# Altium project WPT Round 2.1 RX.PrjPcb
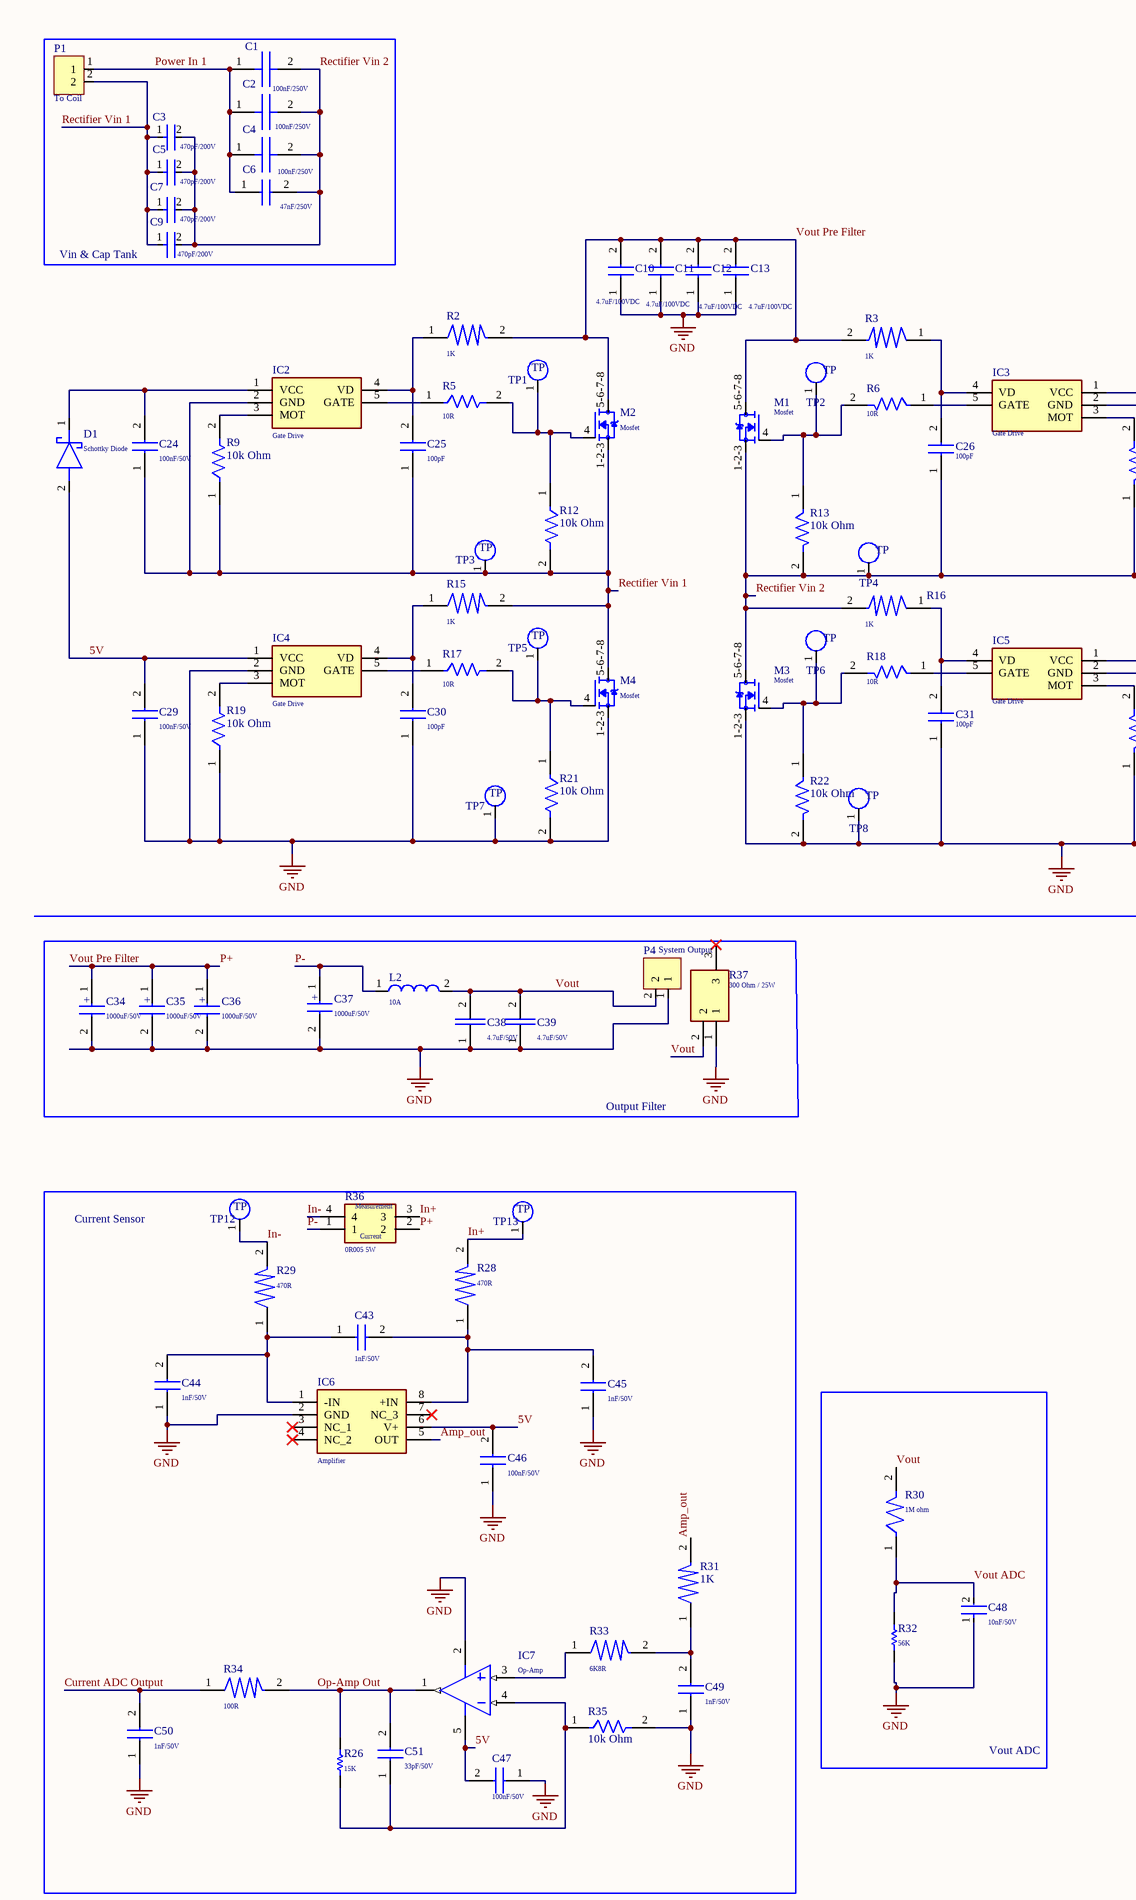
[diagram p0: WPT Round 2.1 RX Schematics.SchDoc, left]
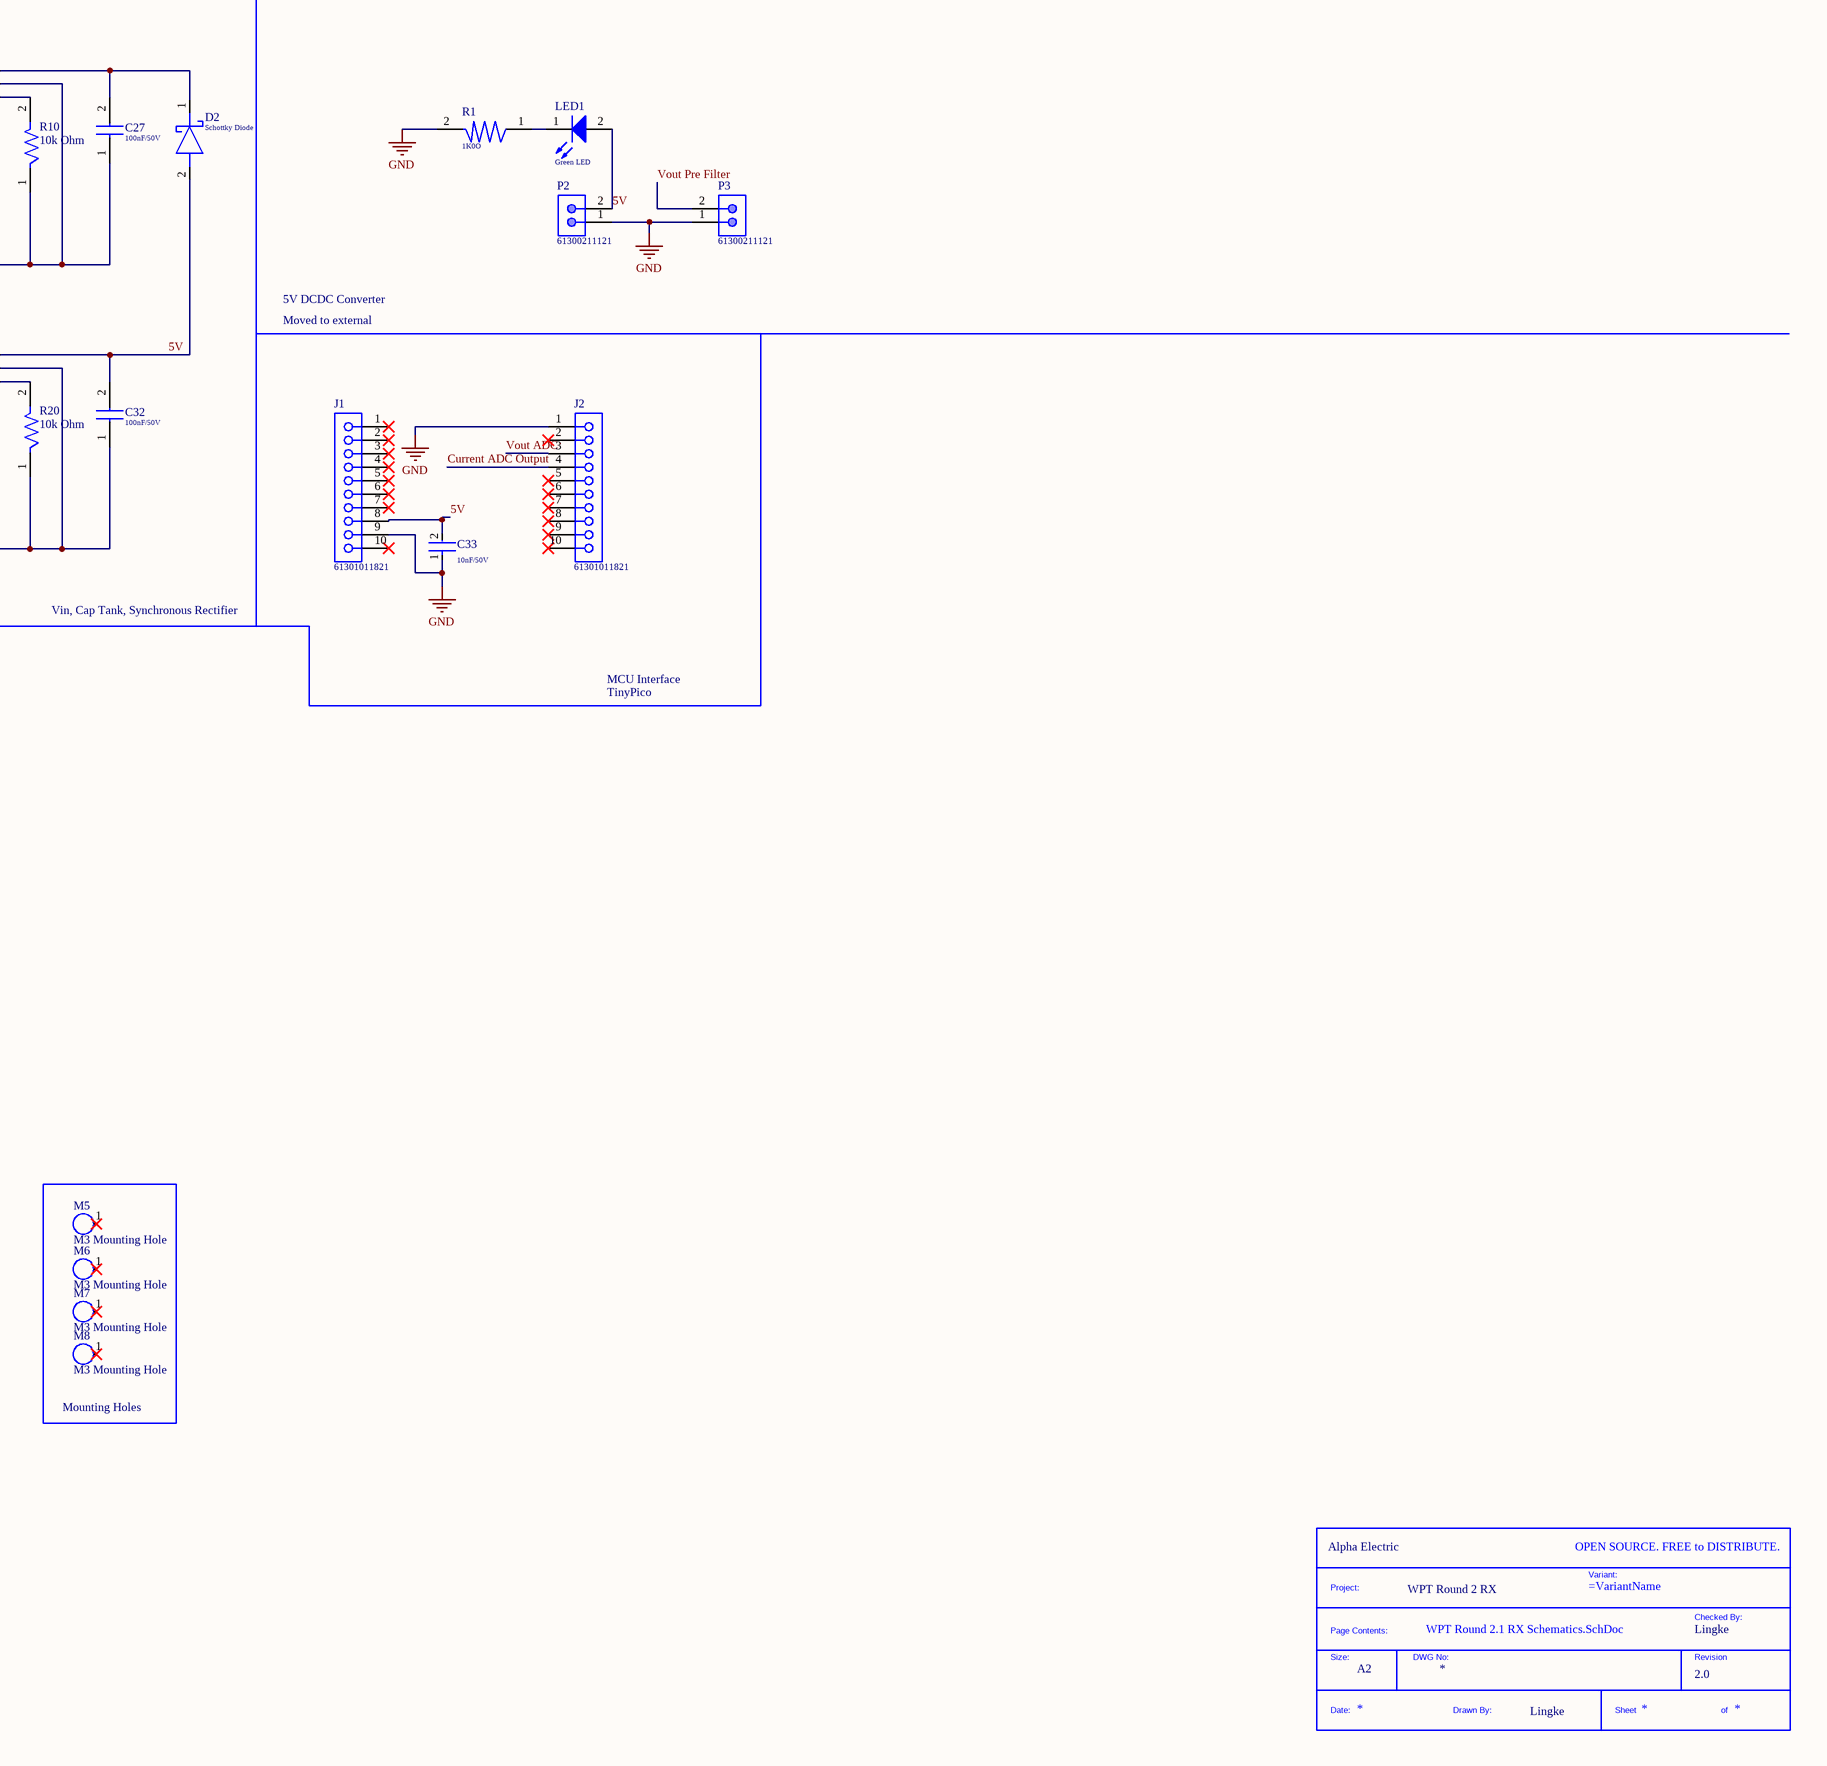
[diagram p1: WPT Round 2.1 RX Schematics.SchDoc, right]
1 sheet, 99 parts. Net scope: global (net labels, ports and power ports of the same name join across sheets).
Board file: WPT Round 2.1 RX Layout.PcbDoc

## Sheet WPT Round 2.1 RX Schematics.SchDoc
size A2

### Parts
*  Project Name: WPT Round 2 RX  Company: Alpha Electric  Drawn By: Lingke  Revision: 2.0  Size: A2  (hidden comment: Title_Block)  (no BOM)
C1  100nF/250V  [CAPC4532X220N]
C2  100nF/250V  [CAPC4532X220N]
C3  470pF/200V  [FP-C1206C-EB-MFG]
C4  100nF/250V  [CAPC4532X220N]
C5  470pF/200V  [FP-C1206C-EB-MFG]
C6  47nF/250V  [CAPC4532X350N]
C7  470pF/200V  [FP-C1206C-EB-MFG]
C9  470pF/200V  [FP-C1206C-EB-MFG]
C10  4.7uF/100VDC  [CAPC3225X280N]
C11  4.7uF/100VDC  [CAPC3225X280N]
C12  4.7uF/100VDC  [CAPC3225X280N]
C13  4.7uF/100VDC  [CAPC3225X280N]
C24  100nF/50V  [CAPC2012X90N]
C25  100pF  [CAPC2012X70N]
C26  100pF  [CAPC2012X70N]
C27  100nF/50V  [CAPC2012X90N]
C29  100nF/50V  [CAPC2012X90N]
C30  100pF  [CAPC2012X70N]
C31  100pF  [CAPC2012X70N]
C32  100nF/50V  [CAPC2012X90N]
C33  10nF/50V  [0805 Capacitor]
C34  1000uF/50V  [CAPPRD500W62D1300H2650]
C35  1000uF/50V  [CAPPRD500W62D1300H2650]
C36  1000uF/50V  [CAPPRD500W62D1300H2650]
C37  1000uF/50V  [CAPPRD500W62D1300H2650]
C38  4.7uF/50V  [CAPC3225X280N]
C39  4.7uF/50V  [CAPC3225X280N]
C43  1nF/50V  [CAPC2012X90N]
C44  1nF/50V  [CAPC2012X90N]
C45  1nF/50V  [CAPC2012X90N]
C46  100nF/50V  [CAPC2012X90N]
C47  100nF/50V  [CAPC2012X90N]
C48  10nF/50V  [0805 Capacitor]
C49  1nF/50V  [CAPC2012X90N]
C50  1nF/50V  [CAPC2012X90N]
C51  33pF/50V  [CAPC2012X90N]
D1  Schottky Diode  [RB400VAM50TR]
D2  Schottky Diode  [RB400VAM50TR]
IC2  Gate Drive  [SOT95P280X145-5N]
IC3  Gate Drive  [SOT95P280X145-5N]
IC4  Gate Drive  [SOT95P280X145-5N]
IC5  Gate Drive  [SOT95P280X145-5N]
IC6  Amplifier  [SOIC127P600X175-8N]
IC7  Op-Amp  [ADI-RJ-5_N]
J1  61301011821  [61301011821]
J2  61301011821  [61301011821]
L2  10A  [WE-PF_1280]
LED1  Green LED  [0805_A]
M1  Mosfet  [TRANS_BSZ037N06LS5ATMA1]
M2  Mosfet  [TRANS_BSZ037N06LS5ATMA1]
M3  Mosfet  [TRANS_BSZ037N06LS5ATMA1]
M4  Mosfet  [TRANS_BSZ037N06LS5ATMA1]
M5  M3 Mounting Hole  [M3 Hole]
M6  M3 Mounting Hole  [M3 Hole]
M7  M3 Mounting Hole  [M3 Hole]
M8  M3 Mounting Hole  [M3 Hole]
P1  To Coil  [691404910002B]
P2  61300211121  [61300211121]
P3  61300211121  [61300211121]
P4  System Output  [691404910002B]
R1  1K0O  [FP-CRCW0805-e3-MFG]
R2  1K  [FP-CRCW0805-e3-MFG]
R3  1K  [FP-CRCW0805-e3-MFG]
R5  10R  [FP-CRCW1206-e3-IPC_A]
R6  10R  [FP-CRCW1206-e3-IPC_A]
R9  10k Ohm  [0805 Resistor]
R10  10k Ohm  [0805 Resistor]
R12  10k Ohm  [0805 Resistor]
R13  10k Ohm  [0805 Resistor]
R15  1K  [FP-CRCW0805-e3-MFG]
R16  1K  [FP-CRCW0805-e3-MFG]
R17  10R  [FP-CRCW1206-e3-IPC_A]
R18  10R  [FP-CRCW1206-e3-IPC_A]
R19  10k Ohm  [0805 Resistor]
R20  10k Ohm  [0805 Resistor]
R21  10k Ohm  [0805 Resistor]
R22  10k Ohm  [0805 Resistor]
R26  15K  [0805 Resistor]
R28  470R  [FP-CRCW0805-e3-MFG]
R29  470R  [FP-CRCW0805-e3-MFG]
R30  1M ohm  [FP-CRCW0805-e3-MFG]
R31  1K  [FP-CRCW0805-e3-MFG]
R32  56K  [0805 Resistor]
R33  6K8R  [FP-CRCW0805-e3-MFG]
R34  100R  [FP-CRCW0805-e3-MFG]
R35  10k Ohm  [0805 Resistor]
R36  0R005 5W  [FC4L110R005FER]
R37  300 Ohm / 25W  [PWR163S253000FE]
TP1  TP  [Test Point]  (value not drawn)  (no BOM)
TP2  TP  [Test Point]  (value not drawn)  (no BOM)
TP3  TP  [Test Point]  (value not drawn)  (no BOM)
TP4  TP  [Test Point]  (value not drawn)  (no BOM)
TP5  TP  [Test Point]  (value not drawn)  (no BOM)
TP6  TP  [Test Point]  (value not drawn)  (no BOM)
TP7  TP  [Test Point]  (value not drawn)  (no BOM)
TP8  TP  [Test Point]  (value not drawn)  (no BOM)
TP12  TP  [Test Point]  (value not drawn)  (no BOM)
TP13  TP  [Test Point]  (value not drawn)  (no BOM)

### Blocks framed on the sheet
Vin & Cap Tank: C1-C7 C9 P1
Output Filter: C34-C39 L2 P4 R37
Current Sensor: C43-C47 C49-C51 IC6 IC7 R26 R28 R29 R31 R33-R36 TP12 TP13
Vout ADC: C48 R30 R32
Mounting Holes: M5-M8

### Nets
GND: C10.1 C11.1 C12.1 C13.1 C29.1 C30.1 C31.1 C32.1 C33.1 C34.2(-) C35.2(-) C36.2(-) C37.2(-) C38.1 C39.1 C44.1 C45.1 C46.1 C47.1 C48.1 C49.1 C50.1 IC4.2(GND) IC5.2(GND) IC6.2(GND) IC7.2(-VS) J1.9 J2.1 M3.1-2-3(S) M4.1-2-3(S) P2.1 P3.1 P4.1 R1.2 R19.1 R20.1 R21.2 R22.2 R32.1 R35.2 R37.1 TP7.1(TP) TP8.1(TP)
5V: C29.2 C32.2 C33.2 C46.2 C47.2 D1.2(A) D2.2(A) IC4.1(VCC) IC5.1(VCC) IC6.6(V+) IC7.5(+VS) J1.8 LED1.2(A) P2.2
Amp_out: IC6.5(OUT) R31.2
Current ADC Output: C50.2 J2.4 R34.1
In+: R28.2 R36.3 TP13.1(TP)
In-: R29.2 R36.4 TP12.1(TP)
Op-Amp Out: C51.2(C2) IC7.1(VOUT) R26.2 R34.2
P+: C10.2 C11.2 C12.2 C13.2 C34.1(+) C35.1(+) C36.1(+) M1.5-6-7-8(D) M2.5-6-7-8(D) P3.2 R2.2 R3.2 R36.2  [also labelled Vout Pre Filter]
P-: C37.1(+) L2.1 R36.1
Power In 1: C1.1 C2.1 C4.1 C6.1 P1.1
Rectifier Vin 1: C3.1 C5.1 C7.1 C9.1 C24.1 C25.1 IC2.2(GND) M2.1-2-3(S) M4.5-6-7-8(D) P1.2 R9.1 R12.2 R15.2 TP3.1(TP)
Rectifier Vin 2: C1.2 C2.2 C3.2 C4.2 C5.2 C6.2 C7.2 C9.2 C26.1 C27.1 IC3.2(GND) M1.1-2-3(S) M3.5-6-7-8(D) R10.1 R13.2 R16.2 TP4.1(TP)
Vout: C38.2 C39.2 L2.2 P4.2 R30.2 R37.2
Vout ADC: C48.2 J2.3 R30.1 R32.2
NetC24_2: C24.2 D1.1(K) IC2.1(VCC)
NetC25_2: C25.2 IC2.4(VD) R2.1
NetC26_2: C26.2 IC3.4(VD) R3.1
NetC27_2: C27.2 D2.1(K) IC3.1(VCC)
NetC30_2: C30.2 IC4.4(VD) R15.1
NetC31_2: C31.2 IC5.4(VD) R16.1
NetC43_1: C43.1 C44.2 IC6.1(-IN) R29.1
NetC43_2: C43.2 C45.2 IC6.8(+IN) R28.1
NetC49_2: C49.2 R31.1 R33.2
NetC51_1: C51.1(C1) IC7.4(-IN) R26.1 R35.1
NetIC2_3: IC2.3(MOT) R9.2
NetIC2_5: IC2.5(GATE) R5.1
NetIC3_3: IC3.3(MOT) R10.2
NetIC3_5: IC3.5(GATE) R6.1
NetIC4_3: IC4.3(MOT) R19.2
NetIC4_5: IC4.5(GATE) R17.1
NetIC5_3: IC5.3(MOT) R20.2
NetIC5_5: IC5.5(GATE) R18.1
NetIC7_3: IC7.3(+IN) R33.1
NetLED1_1: LED1.1(K) R1.1
NetM1_4: M1.4(G) R6.2 R13.1 TP2.1(TP)
NetM2_4: M2.4(G) R5.2 R12.1 TP1.1(TP)
NetM3_4: M3.4(G) R18.2 R22.1 TP6.1(TP)
NetM4_4: M4.4(G) R17.2 R21.1 TP5.1(TP)

Not connected (* = marked no-connect by the designer): IC6 3(NC_1)* 4(NC_2)* 7(NC_3)*; J1 1* 2* 3* 4* 5* 6* 7* 10*; J2 2* 5* 6* 7* 8* 9* 10*; M5 1*; M6 1*; M7 1*; M8 1*; R37 3*

### Notes on the sheet
- 5V DCDC Converter
- Moved to external
- Vin, Cap Tank, Synchronous Rectifier
- MCU Interface
- TinyPico
- (in symbol FC4L110R005FER) Measurement; Current
- (in symbol Title_Block) OPEN SOURCE. FREE to DISTRIBUTE.; Variant:; Project:; Checked By:; Page Contents:; Size:; DWG No:; Revision; Date:; Drawn By:; Sheet; of

### Library data of the parts
* = Title_Block: Standard Title Block.; DWG No: *; Checked By: Lingke
C1 C2 C4 = C1812C104JAGACAUTO: Manufacturer_Name: Kemet; Datasheet Link: https://api.kemet.com/component-edge/download/datasheet/C1812C104JAGACAUTO.pdf; Height: 2.2mm; Manufacturer_Part_Number: C1812C104JAGACAUTO; Supplier Part Number 1: 80-C1812C104JAGAUTO; Supplier 1: Mouser
C3 C5 C7 C9 = C1206C471K2GACTU: CAP CER 470PF 200V 10% NP0 1206; Manufacturer: KEMET; Temperature Coefficient: 15%; Material: Ceramic; Tolerance: 0.1; Automotive Grade: Grade 0; Temperature Characteristic: C0G; Temperature Range High: +150°C; Octopart: https://octopart.com/c1206c471k2gactu-kemet-3658280; Value: 470 pF; ComponentLink2URL: https://content.kemet.com/datasheets/KEM_C1007_X8R_ULTRA_150C_SMD.pdf; Package: C1206C-EB; Ipc Land Pattern Name: CAPC320160X78; Digikey Description: CAP CER 470PF 200V 10% NP0 1206; Device Class L2: Capacitors; Lead Free: Yes; Voltage Rating: 200 V; ComponentLink2Description: Datasheet; Height: 0.88mm; RoHS: TRUE; Temperature Range Low: -55°C; Device Class L1: Passive Components; Device Class L3: Ceramic Capacitors; Category: Cap; Mouser Description: Multilayer Ceramic Capacitors MLCC - SMD/SMT 200volts 470pF C0G 10%; Temperature: -55°C to +150°C; Capacitance: 470 pF; Manufacturer Part Number: C1206C471K2GACTU; Automotive: Yes
C6 = C4532C0G2E473J320KA: Capacitor / 47nF/250V / C0G; Manufacturer_Name: TDK; Datasheet Link: https://product.tdk.com/info/en/catalog/datasheets/mlcc_commercial_midvoltage_en.pdf; Height: 3.5mm; Manufacturer_Part_Number: C4532C0G2E473J320KA; Supplier 1: Mouser; Supplier Part Number 1: 810-C4532C0G2E473J
C10-C13 = CNC6P1X7R2A475K250AE: Manufacturer_Name: TDK; Datasheet Link: https://componentsearchengine.com//CNC6P1X7R2A475K250AE.pdf; Height: 2.8mm; Mouser2 Part Number: 810-CNC6P1X7R2A475K2; Mouser2 Price/Stock: https://www.mouser.com/Search/Refine.aspx?Keyword=810-CNC6P1X7R2A475K2; Manufacturer_Part_Number: CNC6P1X7R2A475K250AE; Supplier 1: Mouser; Supplier Part Number 1: 810-CNC6P1X7R2A475K2
C24 C27 C29 C32 = 885012207098: Capacitor 100nF/50V; Manufacturer_Name: Wurth Elektronik; Datasheet Link: https://componentsearchengine.com//885012207098.pdf; Height: 0.9mm; Mouser2 Part Number: 710-885012207098; Mouser2 Price/Stock: https://www.mouser.com/Search/Refine.aspx?Keyword=710-885012207098; Manufacturer_Part_Number: 885012207098; Supplier 1: Mouser; Supplier Part Number 1: 710-885012207098
C25 C26 C30 C31 = 885012007057: Capacitor 100pF; Manufacturer_Name: Wurth Elektronik; Datasheet Link: https://katalog.we-online.com/pbs/datasheet/885012007057.pdf; Height: 0.7mm; Manufacturer_Part_Number: 885012007057; Supplier 1: Mouser; Supplier Part Number 1: 710-885012007057
C33 C48 = 885012207092: Supplier 1: Mouser; Supplier Part Number 1: 710-885012207092
C34-C37 = ESH108M050AL4AA: Capacitor 1000uF; Supplier 1: Mouser; Supplier Part Number 1: 80-ESH108M050AL4AA
C38 C39 = 885012209048: Capacitor 4.7uF/50V; Manufacturer_Name: Wurth Elektronik; Datasheet Link: https://katalog.we-online.com/pbs/datasheet/885012209048.pdf; Height: 2.8mm; Manufacturer_Part_Number: 885012209048; Supplier 1: Mouser; Supplier Part Number 1: 710-885012209048
C43-C45 C49 C50 = 885012207086: Manufacturer_Name: Wurth Elektronik; Datasheet Link: https://katalog.we-online.com/pbs/datasheet/885012207086.pdf; Height: 0.9mm; Manufacturer_Part_Number: 885012207086; Supplier 1: Mouser; Supplier Part Number 1: 710-885012207086
C46 C47 = 885012207098: Manufacturer_Name: Wurth Elektronik; Height: 0.9mm; Supplier 1: Mouser; Supplier Part Number 1: 710-885012207098
C51 = C0805C330J5GACTU: Capacitor 33pF/50V; Manufacturer_Name: Kemet; Manufacturer_Part_Number: C0805C330J5GACTU; Supplier 1: Mouser; Supplier Part Number 1: 80-C0805C330J5G
D1 D2 = RB400VAM-50TR: Manufacturer_Name: ROHM Semiconductor; Datasheet Link: https://componentsearchengine.com//RB400VAM-50TR.pdf; Height: 0.8mm; Mouser2 Part Number: 755-RB400VAM-50TR; Mouser2 Price/Stock: https://www.mouser.com/Search/Refine.aspx?Keyword=755-RB400VAM-50TR; Manufacturer_Part_Number: RB400VAM-50TR; Supplier Part Number 1: 755-RB400VAM-50TR; Supplier 1: Mouser
IC2-IC5 = IR1161LTRPBF: Gate Driver IC; Manufacturer_Name: Infineon; Height: 1.45mm; Manufacturer_Part_Number: IR1161LTRPBF; Supplier 1: Mouser; Supplier Part Number 1: 942-IR1161LTRPBF
IC6 = AD8215YRZ: Integrated Circuit Amplifier; Manufacturer_Name: Analog Devices; Datasheet Link: http://www.analog.com/static/imported-files/data_sheets/AD8215.pdf; Height: 1.75mm; Manufacturer_Part_Number: AD8215YRZ; Supplier 1: Mouser; Supplier Part Number 1: 584-AD8215YRZ
IC7 = AD8031ARTZ-REEL7: Single Channel RRIO Operational Amplifier, 80 MHz BW, 35 V/us SR, Industrial, 5-pin SOT23 (RJ-5), Reel; Manufacturer: Analog Devices; Generic Part Number: AD8031; V Span Max: 12V; Slew Rate: 35V/us; Input Bias Current: 450nA; Amplifiers Per Package: 1; V Span Min: 2.7V; Iq/Amp: 900uA; Small Signal Bandwidth: 80MHz; Input Offset Voltage: 1mV; ComponentLink4URL: http://www.analog.com/en/all-operational-amplifiers-op-amps/operational-amplifiers-op-amps/ad8031/products/product.html#product-recommendations; PackageDescription: 5-Pin Small Outline Transistor Package, Body 2.9 x 1.6 mm, Pitch 0.95 mm; Mounting Technology: Surface Mount; PackageReference: RJ-5; ComponentLink2Description: Datasheet; ComponentLink1Description: Manufacturer URL; PartNumber: AD8031ARTZ-REEL7; ComponentLink2URL: http://www.analog.com/static/imported-files/data_sheets/AD8031_8032.pdf; ComponentLink3URL: http://www.analog.com/static/imported-files/packages/PKG_PDF/SOT-23(RJ)/RJ_5.pdf; ComponentLink1URL: http://www.analog.com/en/index.html; RevisionNote: Reference Circuit URL fixed; ComponentLink3Description: Package Specification; ComponentLink4Description: Reference Circuit; PackageVersion: 121608-A; DatasheetVersion: Rev. D; Packing: Reel; Code_JEDEC: MO-178-AA; Supplier 1: Mouser; Supplier Part Number 1: 584-AD8031ARTZ-R7
J1 J2 = 61301011821: WR-PHD Socket Header, THT, pitch 2.54mm, Single Row, Vertical, 10p; Manufacturer: Wurth Elektronik; Pin Number: 10; Rated Current: 3A; Working Voltage: 250VAC; Withstanding Voltage: 500VAC; Contact Resistance: 20mOhm; ComponentLink1Description: Manufacturer; ComponentLink1URL: http://www.we-online.de; ComponentLink2Description: Datasheet; ComponentLink2URL: https://www.we-online.com/catalog/datasheet/61301011821.pdf; Manufacturer Part Number: 61301011821; Published Date: May 2020; Pitch: 2.54mm; Operating Temperature: -40 to +125degC; Mounting Technology: THT; Packaging: Tray; Gender: Socket Header; Row Number: Single; Orientation: Vertical
L2 = 742792901: SMD EMI Suppression Power Ferrite WE-PF, Z = 2900 Ohm; PackageVersion: 2007; ComponentLink1URL: http://www.we-online.com; PackageDescription: Inductor, 2-Leads, Body 12.0 x 12.0 mm; ComponentLink1Description: Manufacturer Link; ComponentLink2Description: Datasheet; ComponentLink2URL: http://www.we-online.de/katalog/media/pdf/742792901.pdf; PackageReference: WE-PF; Impedance: 2900 Ohm; DatasheetVersion: ver 6, Apr-2007; Supplier 1: Mouser; Supplier Part Number 1: 710-742792901
LED1 = 150080GS75000: SMD mono-color Chip LED, WL-SMCW, Green; Manufacturer: Wuerth Elektronik; PackageReference: 0805_A; Color: Green; PartNumber: 150080GS75000; ComponentLink2URL: http://katalog.we-online.com/led/datasheet/150080GS75000.pdf; ComponentLink1URL: http://www.we-online.com; ComponentLink1Description: Manufacturer URL; ComponentLink2Description: Datasheet; Supplier 1: Mouser; Supplier Part Number 1: 710-150080GS75000
M1-M4 = BSZ070N08LS5ATMA1: Further performance improvements with best-in-class OptiMOSâ„¢ 5 60V power MOSFET in high performance PQFN 3.3x3.3mm package / MOSFET Diode; MP: BSZ037N06LS5ATMA1; MF: Infineon Technologies; Availability: Unavailable; SnapEDA_Link: https://www.snapeda.com/parts/BSZ037N06LS5ATMA1/Infineon%20Technologies/view-part/4422719/?ref=snap; Value: *; Price: None; Package: TSDSON-8 Infineon Technologies; Supplier 1: Mouser; Supplier Part Number 1: 726-BSZ070N08LS5ATMA
M5-M8 = M3_Mounting_hole
P1 P4 = 691404910002B: Serie 4049 B - 7.50mm Screwless Clamp Power Connector WR-TBL, 2 pin; Manufacturer: Wurth Elektronik; Pin Number: 2; Mounting Technology: THT; Operating Temperature: -40to105degC; Part Number: 691404910002B; Package Reference: 691404910002B; Manufacturer URL: http://www.we-online.de; Publisher: WurthElektronik; Packaging: Box; Datasheet URL: http://katalog.we-online.de/em/datasheet/6914049100xxB.pdf; Pitch: 7.50mm; Supplier Part Number 1: 710-691404910002B; Supplier 1: Mouser
P2 P3 = 61300211121: WR-PHD Pin Header, THT, pitch 2.54mm, Single Row, Vertical, 2p; Manufacturer: Wurth Elektronik; Pin Number: 2; Rated Current: 3A; Working Voltage: 250VAC; Withstanding Voltage: 500VAC; Contact Resistance: 20mOhm; ComponentLink1Description: Manufacturer; ComponentLink1URL: http://www.we-online.de; ComponentLink2Description: Datasheet; ComponentLink2URL: https://www.we-online.com/catalog/datasheet/61300211121.pdf; Manufacturer Part Number: 61300211121; Published Date: May 2020; Pitch: 2.54mm; Operating Temperature: -40 to +105degC; Mounting Technology: THT; Packaging: Bag; Gender: Pin Header; Row Number: Single; Orientation: Vertical
R1 = CRCW08051K00FKEAC: Resistor 1K0 Ohm; Number of Terminations: 2; Supplier 1: Mouser; Supplier Part Number 1: 71-CRCW0805-1.0K-E3
R2 R3 R15 R16 R31 = CRCW08051K00FKEA: Resistor 1k Ohm; Number of Terminations: 2; Supplier 1: Mouser; Supplier Part Number 1: 71-CRCW0805-1.0K-E3
R5 R6 R17 R18 = CRCW120610R0FKEA: RES Thick Film, 10Ω, 1%, 0.25W, 100ppm/°C, 1206 / MOSFET Gate Resistor 10Ohm; Power Rating: 250mW; Voltage Rating (DC): 200V; Number of Terminations: 2; Width: 0.063inch; Case Code (Imperial): 1206; Depth: 1.6mm; Contact Plating: Tin; Radiation Hardening: No; Lead Free: Lead Free; Length: 3.2mm; Tolerance: 1%; Max Power Dissipation: 250mW; Composition: Thick Film; Weight: 0.000353oz; Case/Package: 1206; Number of Pins: 2; Package Quantity: 10; Min Operating Temperature: -55°C; Military Standard: Not; Max Operating Temperature: 155°C; Termination: SMD/SMT; Case Code (Metric): 3216; Voltage Rating: 200V; Height: 0.55mm; Features: Automotive AEC-Q200; Temperature Coefficient: 100ppm/°C; Resistance: 10R; Packaging: Tape and Reel; Supplier 1: Digi-Key; Supplier Part Number 1: 541-10.0FDKR-ND
R9 R10 R12 R13 R19-R22 R35 = CRCW080510K0FKEA: RES Thick Film, 10kΩ, 1%, 0.125W, 100ppm/°C, 0805 / 10k Ohm; Resistance: 10kR; Voltage Rating (DC): 150V; Power Rating: 125mW; Weight: 0.000194oz; Package Quantity: 5000; Military Standard: Not; Max Operating Temperature: 155°C; Temperature Coefficient: 100ppm/°C; Contact Plating: Tin; Width: 1.25mm; Height: 0.45mm; Radiation Hardening: No; Tolerance: 1%; Min Operating Temperature: -55°C; Voltage Rating: 150V; Length: 2mm; Depth: 1.25mm; Termination: SMD/SMT; Packaging: Tape and Reel; Case/Package: 0805; Case Code (Metric): 2012; Lead Free: Lead Free; Case Code (Imperial): 0805; Composition: Thick Film; Supplier 1: Mouser; Supplier Part Number 1: 71-CRCW0805-10K-E3
R26 = ERA-6AED153V: 15K Ohm Resistor; Supplier 1: Mouser; Supplier Part Number 1: 667-ERA-6AED153V
R28 R29 = CRCW0805470RFKEB: Resistor 470 Ohm; Number of Terminations: 2; Supplier 1: Mouser; Supplier Part Number 1: 71-CRCW0805470RFKEB
R30 = CRCW08051M00FKEA: RES Thick Film, 1MΩ, 1%, 0.125W, 100ppm/°C, 0805 / 1M Ohm Resistor; Voltage Rating (DC): 150V; Resistance: 1MR; Power Rating: 125mW; Packaging: Tape and Reel; Case Code (Metric): 2012; Case/Package: 0805; Width: 1.25mm; Mount: Surface Mount; Military Standard: Not; Radiation Hardening: No; Weight: 0.000194oz; Package Quantity: 5000; Max Operating Temperature: 155°C; Contact Plating: Tin; Composition: Thick Film; Number of Pins: 2; Tolerance: 1%; Termination: SMD/SMT; Case Code (Imperial): 0805; Depth: 1.25mm; Temperature Coefficient: 100ppm/°C; Min Operating Temperature: -55°C; Height: 0.45mm; Lead Free: Lead Free; Length: 2mm; Voltage Rating: 150V; Supplier 1: Mouser; Supplier Part Number 1: 71-CRCW08051M00FKEAH
R32 = ERJ-6ENF5622V: 56K Ohm Resistor; Supplier 1: Mouser; Supplier Part Number 1: 667-ERJ-6ENF5622V
R33 = CRCW08056K80FKEA: Resistor 6.8K Ohm; Number of Terminations: 2; Supplier 1: Mouser; Supplier Part Number 1: 71-CRCW0805-6.8K-E3
R34 = CRCW0805100RFKEB: Resistor 100 Ohm; Number of Terminations: 2; Supplier 1: Mouser; Supplier Part Number 1: 71-CRCW0805100RFKEB
R36 = FC4L110R005FER: Resistor 0R005 5W; Manufacturer_Name: Ohmite; Height: 0.7mm; Manufacturer_Part_Number: FC4L110R005FER; Supplier 1: Mouser; Supplier Part Number 1: 588-FC4L110R005FER
R37 = PWR163S-25-3000FE: Resistor 300 Ohm / 25W; Manufacturer_Name: Bourns; Datasheet Link: https://componentsearchengine.com/Datasheets/1/PWR163S-25-3000FE.pdf; Height: 2.79mm; Manufacturer_Part_Number: PWR163S-25-3000FE; Supplier 1: Mouser; Supplier Part Number 1: 652-PWR163S253000FE
TP1-TP8 TP12 TP13 = Test Point: Test Point 1mm by 1mm